# Altium project MCX_BNC_Adapter.PrjPCB
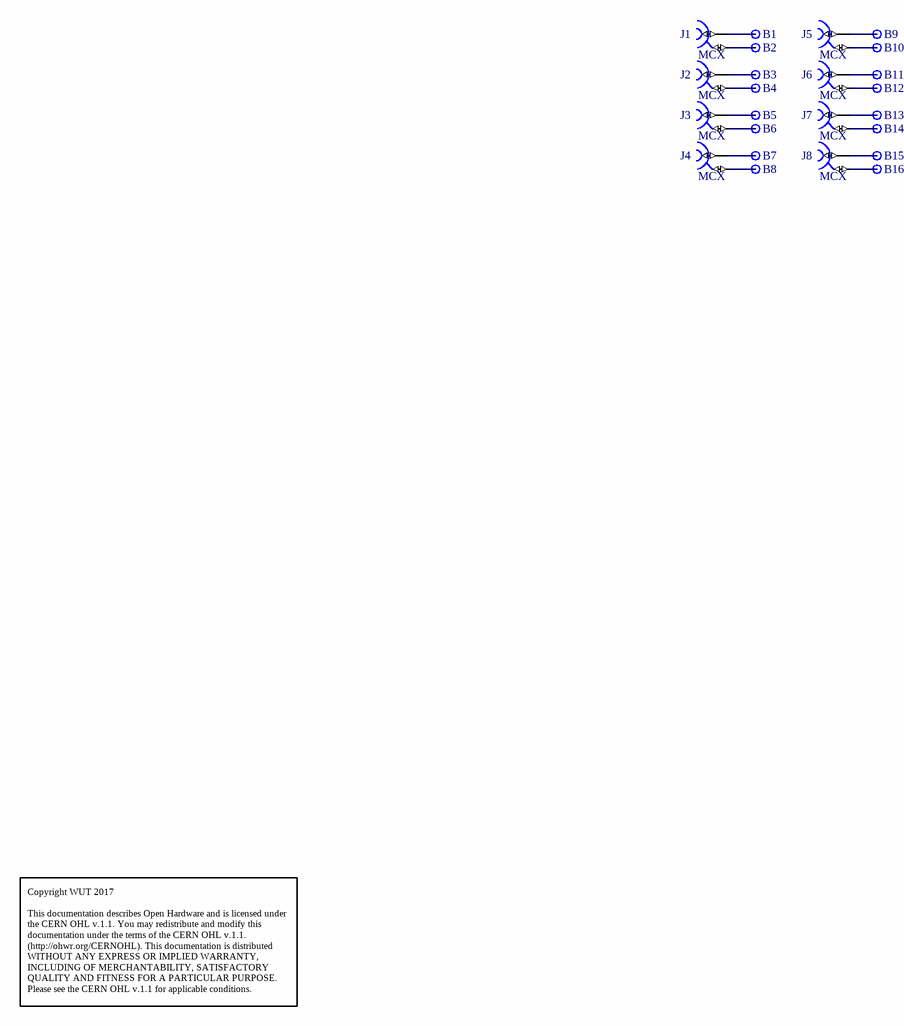
[diagram p0: MCX_BNC_Adapter.SchDoc]
1 sheet, 24 parts. Net scope: global (net labels, ports and power ports of the same name join across sheets).
Board file: MCX_BNC_Adapter.PCBDOC

## Sheet MCX_BNC_Adapter.SchDoc: IDC to BNC
size 420 x 297 mm; Author: G.K.; CompanyName: WUT; DrawnBy: G.K.; Organization: WUT ISE; Address1: Warsaw Univeristy of Technology; Address2: Nowowiejska 15/19; DocumentNumber: 3; Revision: -; SheetNumber: 3; SheetTotal: 7; EDA_Number: ARTIQ; Projet: ARTIQ/SINARA; ModifiedBy: -; CreateDate: XX/XX/XXXX; CheckedDate: -; Title2: adapter v1.1; DivGrp: ISE; Designer: G.K.; ModifiedDate: -; ProjectName: 32 CHANNEL 16bit DAC

### Parts
B1  Plated Hole  [c160h90]  (value not drawn)  (no BOM)
B2  Plated Hole  [c160h90]  (value not drawn)  (no BOM)
B3  Plated Hole  [c160h90]  (value not drawn)  (no BOM)
B4  Plated Hole  [c160h90]  (value not drawn)  (no BOM)
B5  Plated Hole  [c160h90]  (value not drawn)  (no BOM)
B6  Plated Hole  [c160h90]  (value not drawn)  (no BOM)
B7  Plated Hole  [c160h90]  (value not drawn)  (no BOM)
B8  Plated Hole  [c160h90]  (value not drawn)  (no BOM)
B9  Plated Hole  [c160h90]  (value not drawn)  (no BOM)
B10  Plated Hole  [c160h90]  (value not drawn)  (no BOM)
B11  Plated Hole  [c160h90]  (value not drawn)  (no BOM)
B12  Plated Hole  [c160h90]  (value not drawn)  (no BOM)
B13  Plated Hole  [c160h90]  (value not drawn)  (no BOM)
B14  Plated Hole  [c160h90]  (value not drawn)  (no BOM)
B15  Plated Hole  [c160h90]  (value not drawn)  (no BOM)
B16  Plated Hole  [c160h90]  (value not drawn)  (no BOM)
J1  MCX  [AMPHENOL_919-383J-51A]
J2  MCX  [AMPHENOL_919-383J-51A]
J3  MCX  [AMPHENOL_919-383J-51A]
J4  MCX  [AMPHENOL_919-383J-51A]
J5  MCX  [AMPHENOL_919-383J-51A]
J6  MCX  [AMPHENOL_919-383J-51A]
J7  MCX  [AMPHENOL_919-383J-51A]
J8  MCX  [AMPHENOL_919-383J-51A]

### Nets
NetB1_1: B1.1 J1.1
NetB2_1: B2.1 J1.2
NetB3_1: B3.1 J2.1
NetB4_1: B4.1 J2.2
NetB5_1: B5.1 J3.1
NetB6_1: B6.1 J3.2
NetB7_1: B7.1 J4.1
NetB8_1: B8.1 J4.2
NetB9_1: B9.1 J5.1
NetB10_1: B10.1 J5.2
NetB11_1: B11.1 J6.1
NetB12_1: B12.1 J6.2
NetB13_1: B13.1 J7.1
NetB14_1: B14.1 J7.2
NetB15_1: B15.1 J8.1
NetB16_1: B16.1 J8.2

### Notes on the sheet
- Copyright WUT 2017
  This documentation describes Open Hardware and is licensed under the CERN OHL v.1.1. You may redistribute and modify this documentation under the terms of the CERN OHL v.1.1. (http://ohwr.org/CERNOHL). This documentation is distributed WITHOUT ANY EXPRESS OR IMPLIED WARRANTY, INCLUDING OF MERCHANTABILITY, SATISFACTORY QUALITY AND FITNESS FOR A PARTICULAR PURPOSE. Please see the CERN OHL v.1.1 for applicable conditions.
- Project/Equipment
- Document
- Designer
- Drawn by
- Check.by
- File
- Last Mod.
- Print Date
- Sheet
- Size
- A3
- of
- Rev

### Library data of the parts
B1-B16 = PLATED_HOLE0.9_PAD1.6: Single Terminal Socket; Part Description: Plated Through Hole: Hole Dia.=0.9mm Pad Dia.=1.6mm, IPC-7251 Level A; Mounted: No; Part Number: PLATED_HOLE0.9_PAD1.6; Component Type: Standard (No BOM); Pin Count: 1; Family: Plated Hole; Socket: No; SMD: No; Sense: No; Status: None; ComponentHeight: 0mm; HelpURL: Undefined; Author: CERN DEM JLC; CreateDate: 11.05.2017; LatestRevisionDate: 11.05.2017; PackageDescription: Plated Through Hole: Hole Dia.=0.9mm Pad Dia.=1.6mm, IPC-7251 Level A
J1-J8 = AMPHENOL_919-383J-51A: Part Description: 50 Ohm, RF Connector, MCX Right Angle PCB Receptacle Jack; PressFit: No; Part Number: AMPHENOL_919-383J-51A; Component Kind: Standard; Component Type: Standard; Pin Count: 5; Family: MCX; Mounted: Yes; Socket: No; SMD: No; Sense: No; Status: None; Manufacturer: AMPHENOL; Manufacturer Part Number: 919-383J-51A; ComponentHeight: 6mm; HelpURL: \\cern.ch\dfs\Applications\Altium\Datasheets\AMPHENOL_919-383J-51A.pdf; Author: CERN DEM BC; CreateDate: 31.01.2019; LatestRevisionDate: 31.01.2019